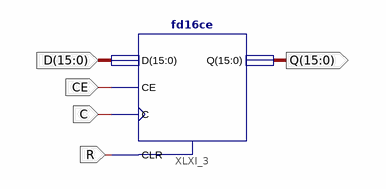
[diagram p0: schematic sheet 1]
// Xilinx ISE schematic register16b.sch (spartan3e) as structural Verilog: 1 symbols, 5 ports
module register16b (
  input  CE,
  input  C,
  input  [15:0] D,
  input  R,
  output [15:0] Q
);

  fd16ce XLXI_3 (.C(C), .CE(CE), .CLR(R), .D(D), .Q(Q));
endmodule
